# EAGLE design OpenLogAnalog (EAGLE 5.11)
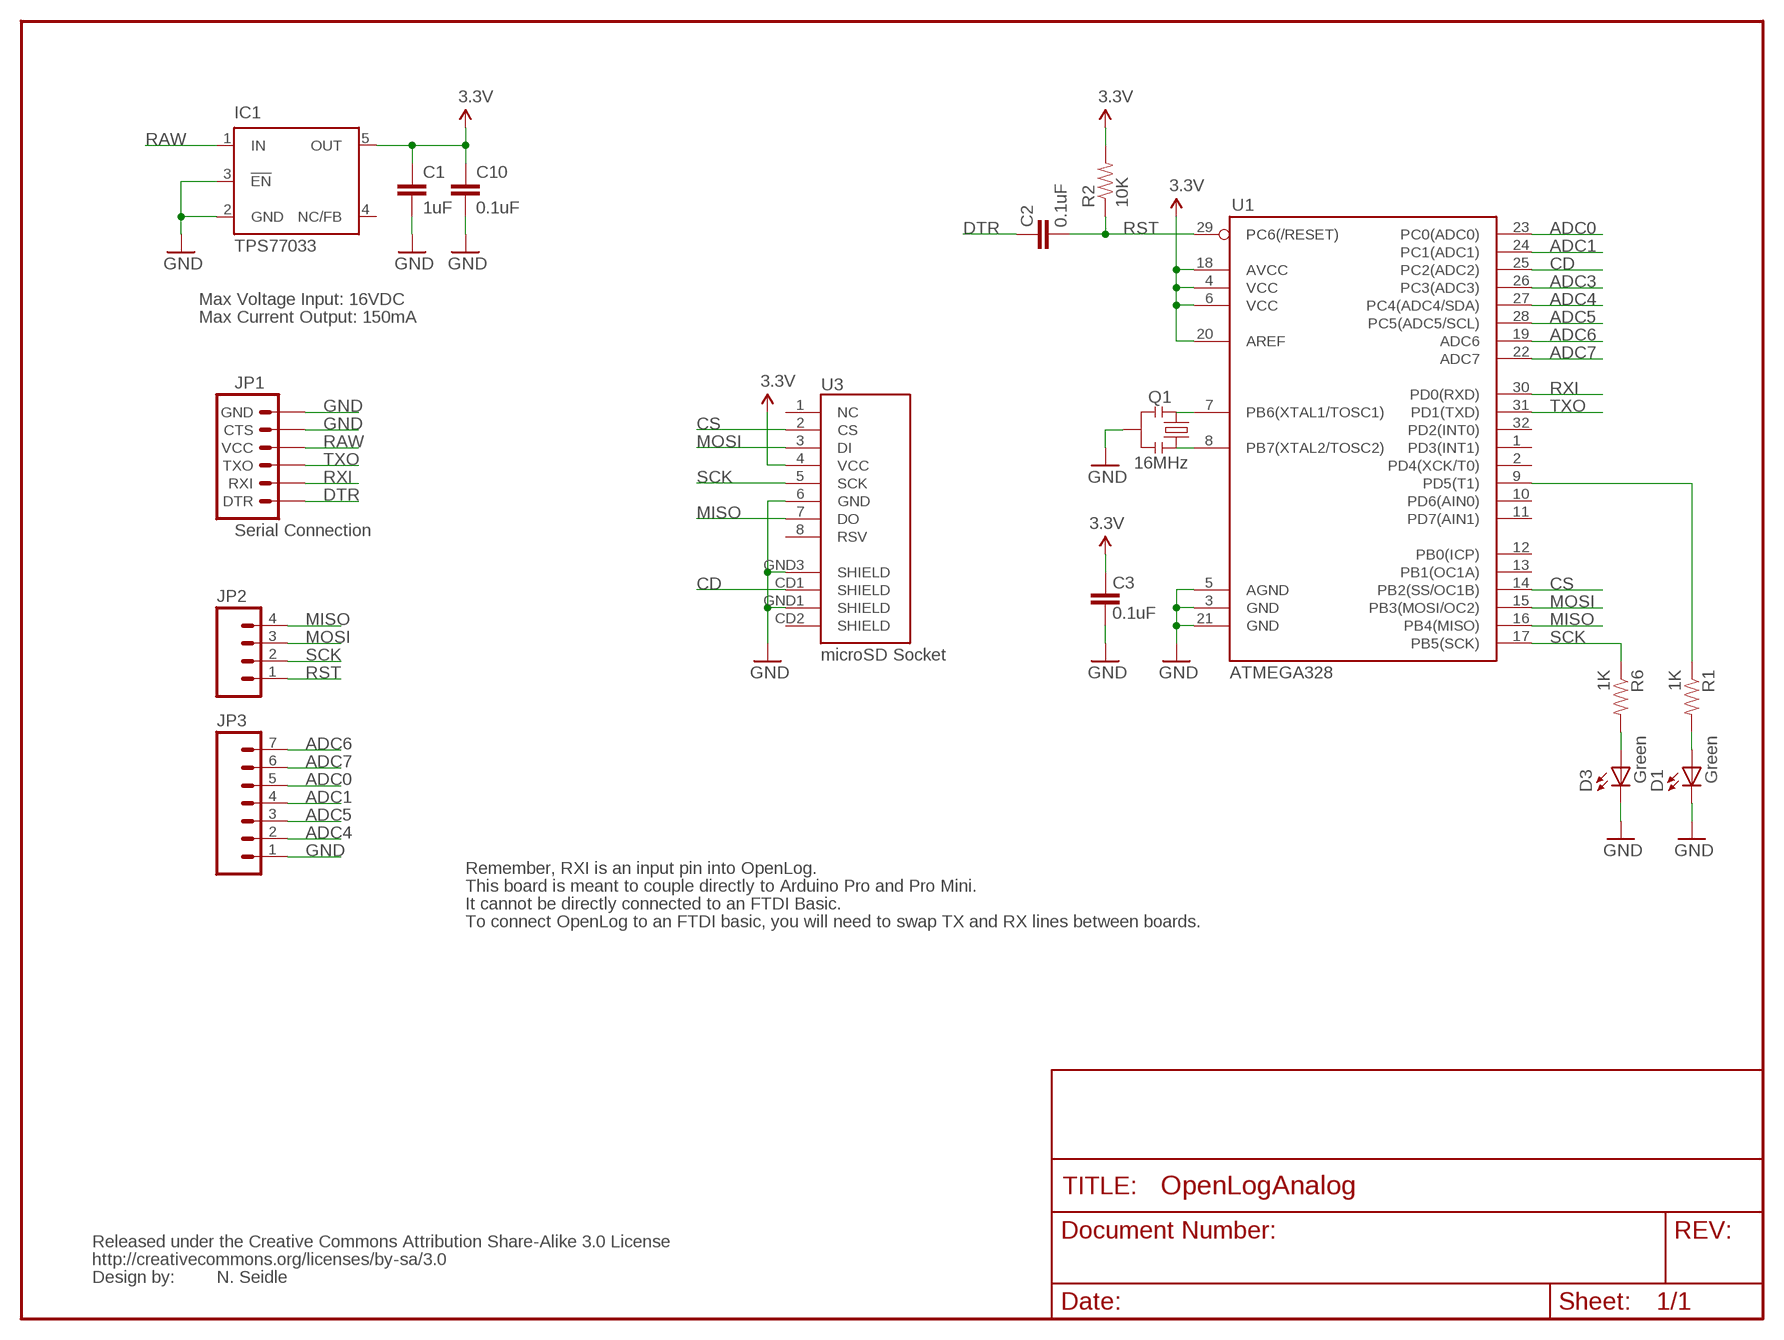
[diagram p0: schematic, sheet 1]

## Parts
C1  1uF  CAP0402-CAP  [0402-CAP]
C2  0.1uF  CAP0402-CAP  [0402-CAP]
C3  0.1uF  CAP0402-CAP  [0402-CAP]
C10  0.1uF  CAP0402-CAP  [0402-CAP]
D1  Green  LED0603  [LED-0603]
D3  Green  LED0603  [LED-0603]
IC1  TPS77033  [SOT23-DBV]
JP1  Serial Connection  ARDUINO_SERIAL_PROGRAMPTH  [1X06]
JP2  M04PTH  [1X04]
JP3  M07  [1X07]
Q1  16MHz  RESONATORSMD  [RESONATOR-SMD]
R1  1K  RESISTOR0402-RES  [0402-RES]
R2  10K  RESISTOR0402-RES  [0402-RES]
R6  1K  RESISTOR0402-RES  [0402-RES]
U1  ATMEGA328  ATMEGA168  [TQFP32-08]
U3  microSD Socket  USD-SOCKETNEW  [MICRO-SD-SOCKET-PP]
U$2  CREATIVE_COMMONS  [CREATIVE_COMMONS]

## Nets
3.3V: C1.1 C3.2 C10.1 IC1.5(OUT) R2.2 U1.4(VCC) U1.6(VCC) U1.18(AVCC) U1.20(AREF) U3.4(VCC)
ADC0: JP3.5 U1.23(PC0(ADC0))
ADC1: JP3.4 U1.24(PC1(ADC1))
ADC3: U1.26(PC3(ADC3))
ADC4: JP3.2 U1.27(PC4(ADC4/SDA))
ADC5: JP3.3 U1.28(PC5(ADC5/SCL))
ADC6: JP3.7 U1.19(ADC6)
ADC7: JP3.6 U1.22(ADC7)
CD: U1.25(PC2(ADC2)) U3.CD1(SHIELD)
CS: U1.14(PB2(SS/OC1B)) U3.2(CS)
DTR: C2.2 JP1.1(DTR)
GND [vcc]: C1.2 C3.1 C10.2 D1.C D3.C IC1.2(GND) IC1.3(!EN) JP1.5(CTS) JP1.6(GND) JP3.1 Q1.2 U1.3(GND) U1.5(AGND) U1.21(GND) U3.6(GND) U3.GND1(SHIELD) U3.GND3(SHIELD)
MISO: JP2.4 U1.16(PB4(MISO)) U3.7(DO)
MOSI: JP2.3 U1.15(PB3(MOSI/OC2)) U3.3(DI)
N$1: Q1.1 U1.8(PB7(XTAL2/TOSC2))
N$2: Q1.3 U1.7(PB6(XTAL1/TOSC1))
N$3: D1.A R1.2
N$4: R1.1 U1.9(PD5(T1))
N$7: D3.A R6.2
RAW [vcc]: IC1.1(IN) JP1.4(VCC)
RST: C2.1 JP2.1 R2.1 U1.29(PC6(/RESET))
RXI: JP1.2(RXI) U1.30(PD0(RXD))
SCK: JP2.2 R6.1 U1.17(PB5(SCK)) U3.5(SCK)
TXO: JP1.3(TXO) U1.31(PD1(TXD))
Unconnected: IC1.4(NC/FB) U1.1(PD3(INT1)) U1.2(PD4(XCK/T0)) U1.10(PD6(AIN0)) U1.11(PD7(AIN1)) U1.12(PB0(ICP)) U1.13(PB1(OC1A)) U1.32(PD2(INT0)) U3.1(NC) U3.8(RSV) U3.CD2(SHIELD)

## Notes on the sheet
- Max Voltage Input: 16VDC
- Max Current Output: 150mA
- Remember, RXI is an input pin into OpenLog.
- This board is meant to couple directly to Arduino Pro and Pro Mini.
- It cannot be directly connected to an FTDI Basic.
- To connect OpenLog to an FTDI basic, you will need to swap TX and RX lines between boards.
- N. Seidle

## Library data of the parts
C1-C3 C10 = SparkFun:CAP: Capacitor Standard 0603 ceramic capacitor, and 0.1" leaded capacitor.
D1 D3 = SparkFun:LED: LEDs Standard schematic elements and footprints for 5mm, 3mm, 1206, and 0603 sized LEDs. 5mm - Spark Fun Electronics SKU : COM-00529 (and others)
IC1 = texas:TPS770*: ULTRALOW-POWER 50-mA LOW-DROPOUT LINEAR REGULATORS 50-mA Low-Dropout Regulator Source: http://focus.ti.com/lit/ds/symlink/tps77001.pdf; MF: TEXAS INSTRUMENTS; MPN: TPS77033DBVT; OC_FARNELL: 8461570; OC_NEWARK: 77C1187
JP1 = SparkFun:ARDUINO_SERIAL_PROGRAM
JP2 = SparkFun:M04: Header 4 Standard 4-pin 0.1" header. Use with straight break away headers (SKU : PRT-00116), right angle break away headers (PRT-00553), swiss pins (PRT-00743), machine pins (PRT-00117), and female headers (PRT-00115). Molex polarized connector foot print use with SKU : PRT-08231 with associated crimp pins and housings.
JP3 = SparkFun:M07: Header 7 Standard 7-pin 0.1" header. Use with straight break away headers (SKU : PRT-00116), right angle break away headers (PRT-00553), swiss pins (PRT-00743), machine pins (PRT-00117), and female headers (PRT-00115). NOTES ON THE VARIANTS LOCK and LOCK_LONGPADS... This footprint was designed to help hold the alignment of a through-hole component (i.e. 7-pin header) while soldering it into place. You may notice that each hole has been shifted either up or down by 0.005 of an inch from it's more standard position (which is usually a perfectly straight line). This slight alteration caused the pins (the squares in the middle) to touch the edges of the holes. Because they are alternating, it causes a "brace" to hold the header in place. 0.005 has proven to be the perfect amount of "off-center" position when using our standard breakaway headers. Although looks a little odd when you look at the bare footprint, once you have a header in there, the alteration is very hard to notice. Also, if you push a header all the way into place, it is covered up entirely on the bottom side. This idea of altering the position of holes to aid alignment will be further integrated into the Sparkfun Library for other footprints. It can help hold any component with 3 or more connection pins.
Q1 = SparkFun:RESONATOR: Resonator Small SMD resonator. This is the itty bitty 10/20MHz resonators with built in caps. CSTCE10M0G55 and CSTCE20M0V53. Footprint has been reviewed closely but hasn't been tested yet.
R1 R2 R6 = SparkFun:RESISTOR: Resistor Basic schematic elements and footprints for 0603, 1206, and PTH 1/10th watt (small) resistors.
U1 = SparkFun:ATMEGA168
U3 = SparkFun:USD-SOCKET: microSD Socket Push-push type uSD socket. Schematic element and footprint production proven. Spark Fun Electronics SKU : PRT-00127. tDoc lines correctly indicate media card edge positions when inserting (unlocked, locked, depressed).
U$2 = SparkFun:CREATIVE_COMMONS

## Net classes
0 default: width 0.178 mm
1 vcc: width 0.203 mm

## Board
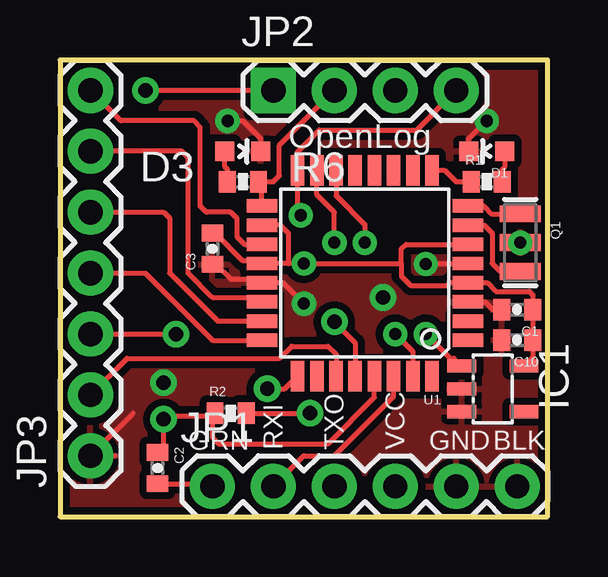
[diagram p1: board, top side]
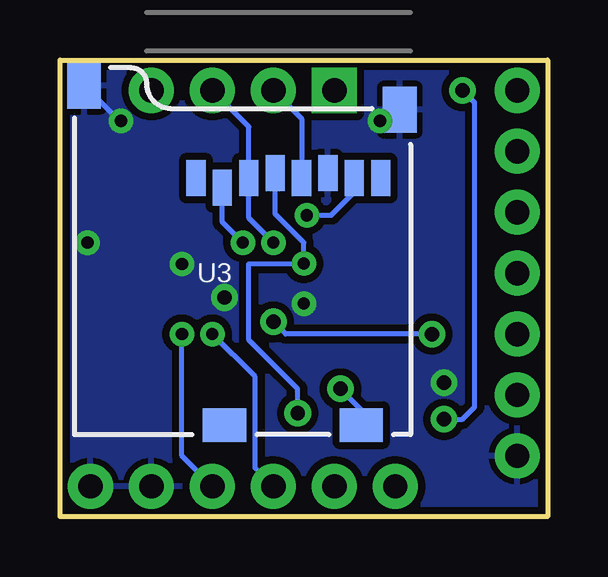
[diagram p2: board, bottom side, seen from below]

Size 20.32 x 19.05 mm. Coordinates in mm from the lower left corner, seen from the top.
Outline: 20.32,0 20.32,19.05 0,19.05 0,0 20.32,0
Copper layers (1*16): Top 0.035mm / dielectric 1.5mm / Bottom 0.035mm
Design rules "SparkFun *": minimum track width 8mil, minimum drill 20mil, track to track 8mil, track to pad 8mil, pad to pad 8mil, via to via 8mil, smd to smd 8mil, copper to edge 10mil, drill to drill 8mil, minimum pad ring 12mil, minimum via ring 10mil, stop-mask expansion 4mil, vias tented up to drill 20mil, thermal gap 10mil

### Footprints (pad centres in the part's own frame; a part is rotated, then mirrored left to right if it is on the bottom)
0402-CAP = smd 0.7 x 0.9: 1 -0.65,0; 2 0.65,0
LED-0603 = smd 0.8 x 0.8: A 0,-0.75; C 0,0.75
SOT23-DBV = smd 0.55 x 1.2: 1 -0.95,-1.3; 2 0,-1.3; 3 0.95,-1.3; 4 0.95,1.3; 5 -0.95,1.3
1X06 = drill 1.016 pad 1.88 round: 1 0,0; 2 2.54,0; 3 5.08,0; 4 7.62,0; 5 10.16,0; 6 12.7,0
1X04 = drill 1.016 pad 1.88 square: 1 0,0 | drill 1.016 pad 1.88 round: 2 2.54,0; 3 5.08,0; 4 7.62,0
1X07 = drill 1.016 pad 1.88 round: 1 0,0; 2 2.54,0; 3 5.08,0; 4 7.62,0; 5 10.16,0; 6 12.7,0; 7 15.24,0
RESONATOR-SMD = smd 0.7 x 1.7: 1 -1.2,0; 2 0,0; 3 1.2,0
0402-RES = smd 0.7 x 0.9: 1 -0.65,0; 2 0.65,0
TQFP32-08 = smd 1.27 x 0.559: 1 -4.293,2.8; 2 -4.293,2; 3 -4.293,1.2; 4 -4.293,0.4; 5 -4.293,-0.4; 6 -4.293,-1.2; 7 -4.293,-2; 8 -4.293,-2.8; 17 4.293,-2.8; 18 4.293,-2; 19 4.293,-1.2; 20 4.293,-0.4; 21 4.293,0.4; 22 4.293,1.2; 23 4.293,2; 24 4.293,2.8 | smd 0.559 x 1.27: 9 -2.8,-4.293; 10 -2,-4.293; 11 -1.2,-4.293; 12 -0.4,-4.293; 13 0.4,-4.293; 14 1.2,-4.293; 15 2,-4.293; 16 2.8,-4.293; 25 2.8,4.293; 26 2,4.293; 27 1.2,4.293; 28 0.4,4.293; 29 -0.4,4.293; 30 -1.2,4.293; 31 -2,4.293; 32 -2.8,4.293
MICRO-SD-SOCKET-PP = smd 0.8 x 1.5: 1 -8.94,10.7; 2 -7.84,10.3; 3 -6.74,10.7; 4 -5.64,10.9; 5 -4.54,10.7; 6 -3.44,10.9; 7 -2.34,10.7; 8 -1.24,10.7 | smd 1.8 x 1.4: CD1 -2.05,0.4; CD2 -7.75,0.4 | smd 1.4 x 1.9: GND1 -13.6,14.55; GND3 -0.45,13.55

### Placement (x,y rotation side)
C1  19.05,8.64 180 top
C2  4.06,2.03 270 top
C3  6.35,11.18 90 top
C10  19.05,7.37 180 top
D1  17.78,15.24 90 top
D3  7.62,15.24 270 top
IC1  18.03,5.33 270 top
JP1  6.35,1.27 0 top
JP2  8.89,17.78 0 top
JP3  1.27,2.54 90 top
Q1  19.18,11.43 270 top
R1  17.78,13.97 0 top
R2  7.11,4.32 0 top
R6  7.62,13.97 180 top
U1  12.7,10.16 180 top
U3  5.71,3.43 0 bottom
U$2  19.05,-11.43 0 top  (outside the outline)

### Tracks (layer width: path | path; a pad name or v marks a point on that pad's centre or on a via)
3.3V  (via drill 0.51, 0.6 pad 0.61)
  Top 0.203: 9.53,10.56 U1.20 | U1.18 9.18,12.16 9.53,11.81 9.53,10.56 | 9.53,10.56 v10.16,10.56 14.21,10.56 | U1.6 14.41,11.36 14.22,11.18 14.22,10.58 14.21,10.56 | 14.21,10.56 14.22,10.54 14.22,10.03 14.61,9.65 16.13,9.65 16.24,9.76 U1.4 17.8,9.76 18.16,9.4 19.56,9.4 19.7,9.26 C1.1 C10.1 19.7,6.65 IC1.5 | U1.20 8.37,10.53 | C3.2 6.46,11.83 7.62,10.67 8.3,10.67 U1.20 | R2.2 v10.41,4.32
  Bottom 0.203: U3.4 11.36,12.62 10.16,11.43 v10.16,10.56 12.45,10.56 12.45,7.37 10.41,5.33 v10.41,4.32
ADC0
  Top 0.203: U1.23 6.57,8.16 4.57,10.16 4.57,12.45 4.32,12.7 JP3.5
ADC1
  Top 0.203: JP3.4 3.56,10.16 6.36,7.36 U1.24
ADC4
  Top 0.203: U1.27 11.5,6.79 11.18,7.11 9.65,7.11 9.14,6.6 2.79,6.6 JP3.2
ADC5  (via drill 0.6 pad 0.61)
  Top 0.203: U1.28 12.3,7.26 v11.43,8.13 | JP3.3 v4.83,7.62
  Bottom 0.203: v4.83,7.62 10.92,7.62 v11.43,8.13
ADC6
  Top 0.203: U1.19 7.69,11.36 7.37,11.68 7.37,12.45 7.11,12.7 6.1,12.7 5.84,12.95 5.84,16.26 5.59,16.51 2.54,16.51 JP3.7
ADC7
  Top 0.203: U1.22 8.22,9.14 6.35,9.14 5.33,10.16 5.33,14.99 5.08,15.24 JP3.6
CD  (via drill 0.6)
  Top 0.203: v8.64,5.33 9.37,5.33 U1.25
  Bottom 0.203: U3.CD1 7.76,4.46 v8.64,5.33
CS  (via drill 0.51)
  Top 0.203: U1.14 11.5,13.39 12.7,12.19 v12.7,11.43
  Bottom 0.203: 13.55,13.55 U3.2 13.55,12.29 v12.7,11.43
DTR
  Top 0.203: C2.2 6.35,1.38 JP1.1
GND  (via drill 0.51, 0.6 pad 0.61)
  Top 0.203: C1.2 18.03,8.64 17.71,8.96 U1.3 | v15.24,10.54 16.99,10.54 U1.5 | v10.16,8.89 9.29,9.76 U1.21 8.26,9.91 7.11,9.91 6.49,10.53 C3.1 | D3.C 8.37,15.76 7.62,16.51 v6.99,16.51 | D1.C 17.03,15.76 v17.78,16.51 | 2.29,2.54 JP3.1 3.05,4.32
  Bottom 0.203: v17.78,16.51 17.85,16.51 U3.GND1
  other vias: 19.18,11.43 13.46,9.14 4.32,5.59
  pour Top (isolate 0.305): 20.32,0 0,0 0,19.05 20.32,19.05
  pour Bottom (isolate 0.305): 20.32,0 0,0 0,19.05 20.32,19.05
MISO  (via drill 0.51)
  Top 0.203: JP2.4 14.86,16.13 10.79,16.13 9.9,15.23 U1.16 9.9,12.71 v10.03,12.57
  Bottom 0.203: U3.7 8.05,13.54 9.02,12.57 v10.03,12.57
MOSI  (via drill 0.51)
  Top 0.203: U1.15 10.7,13.43 11.43,12.7 v11.43,11.43
  Bottom 0.203: JP2.3 12.46,16.27 U3.3 12.46,12.46 v11.43,11.43
N$1
  Top 0.203: U1.8 17.65,12.96 17.98,12.63 Q1.1
N$2
  Top 0.203: Q1.3 18.34,10.23 18.01,10.57 18.01,11.84 17.68,12.16 U1.7
N$3
  Top 0.203: R1.2 18.43,14.49 18.54,14.61 18.54,15.23 D1.A
N$4
  Top 0.203: U1.9 16.03,14.45 16.51,13.97 R1.1
N$7
  Top 0.203: D3.A 6.87,14.59 6.99,14.48 6.99,13.98 R6.2
RAW  (via drill 0.51)
  Top 0.203: 15.4,7.62 15.4,7.46 16.26,6.6 16.41,6.6 IC1.1
  Top 0.254: v15.24,7.62 15.4,7.62
  Bottom 0.203: v15.24,7.62 15.24,2.54 JP1.4
RST  (via drill 0.6)
  Top 0.203: U1.29 13.1,4.97 11.18,3.05 6.6,3.05 6.35,3.3 6.35,4.21 | 6.35,4.21 R2.1 | v3.56,17.78 JP2.1 | 6.35,4.21 4.32,4.21 v4.32,4.06 4.32,2.68 C2.1
  Bottom 0.203: v3.56,17.78 3.05,17.27 3.05,4.57 3.56,4.06 v4.32,4.06
RXI
  Top 0.203: U1.30 13.9,5.01 11.43,2.54 10.16,2.54 JP1.2
SCK
  Top 0.203: U1.17 8.41,13.83 R6.1 8.89,13.97 9.14,14.22 9.14,15.49 JP2.2
  Bottom 0.203: U3.5 10.26,16.61 JP2.2
TXO  (via drill 0.51)
  Top 0.203: U1.31 14.7,6.89 v13.97,7.62
  Bottom 0.203: v13.97,7.62 12.19,5.84 12.19,2.03 JP1.3

### Text on the board
tPlace: OpenLog | GRN | RXI | TXO | VCC | GND | BLK | N. Seidle